# EAGLE design Lightpack5.5 (EAGLE 6.2)
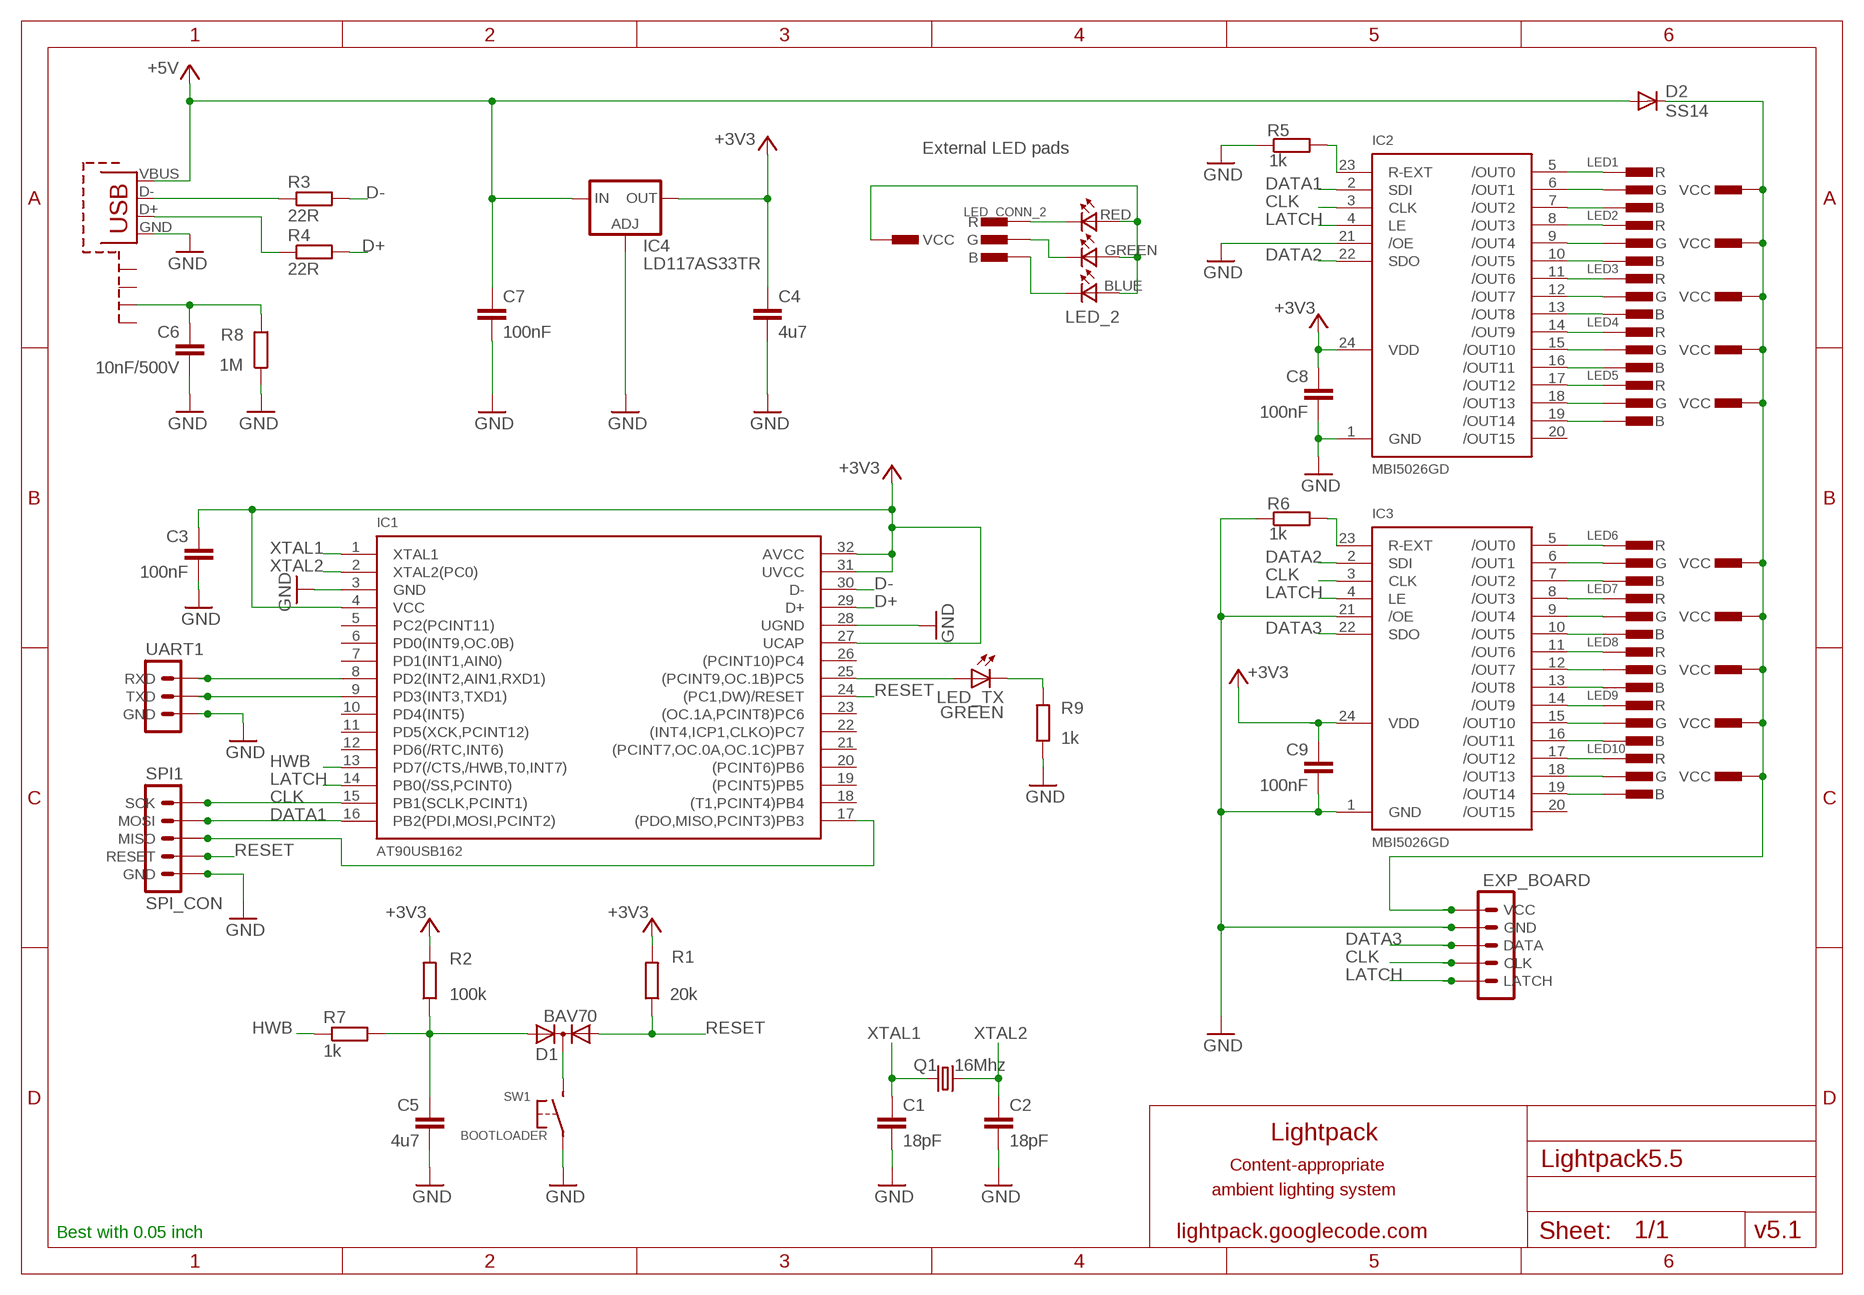
[diagram p0: schematic, sheet 1]

## Parts
C1  18pF  C-EUC1206  [C1206]
C2  18pF  C-EUC1206  [C1206]
C3  100nF  C-EUC1206  [C1206]
C4  4u7  C-EUC1206  [C1206]
C5  4u7  C-EUC1206  [C1206]
C6  10nF/500V  C-EUC1206  [C1206]
C7  100nF  C-EUC1206  [C1206]
C8  100nF  C-EUC1206  [C1206]
C9  100nF  C-EUC1206  [C1206]
D1  BAV70  DIODE-2AC|CASOT23  [SOT23]
D2  SS14  DIODE-SMB  [SMB]
EXP_BOARD  MA05-1  [MA05-1]
IC1  AT90USB162  [TQFP32]
IC2  MBI5026GD  [SOP24-300-1.27]
IC3  MBI5026GD  [SOP24-300-1.27]
IC4  LD117AS33TR  [SOT223]
LED1  CON-RGB-LED  CON-RGB-LED-TH  [CON-RGB-LED-TH]
LED2  CON-RGB-LED  CON-RGB-LED-TH  [CON-RGB-LED-TH]
LED3  CON-RGB-LED  CON-RGB-LED-TH  [CON-RGB-LED-TH]
LED4  CON-RGB-LED  CON-RGB-LED-TH  [CON-RGB-LED-TH]
LED5  CON-RGB-LED  CON-RGB-LED-TH  [CON-RGB-LED-TH]
LED6  CON-RGB-LED  CON-RGB-LED-TH  [CON-RGB-LED-TH]
LED7  CON-RGB-LED  CON-RGB-LED-TH  [CON-RGB-LED-TH]
LED8  CON-RGB-LED  CON-RGB-LED-TH  [CON-RGB-LED-TH]
LED9  CON-RGB-LED  CON-RGB-LED-TH  [CON-RGB-LED-TH]
LED10  CON-RGB-LED  CON-RGB-LED-TH  [CON-RGB-LED-TH]
LED_2  TOPLED-3RF-W2SA50TS  [LP2C63-ST-RGB-SR0]
LED_CONN_2  CON-RGB-LED  CON-RGB-LED-EXT  [CON-RGB-LED-TH-EXT]
LED_TX  GREEN  LEDCHIPLED_0805  [CHIPLED_0805]
Q1  16Mhz  CRYSTALHC49UP  [HC49UP]
R1  20k  R-EU_R1206  [R1206]
R2  100k  R-EU_R1206_2  [R1206]
R3  22R  R-EU_R1206  [R1206]
R4  22R  R-EU_R1206  [R1206]
R5  1k  R-EU_R1206  [R1206]
R6  1k  R-EU_R1206  [R1206]
R7  1k  R-EU_R1206  [R1206]
R8  1M  R-EU_R1206  [R1206]
R9  1k  R-EU_R1206  [R1206]
SPI1  SPI_CON  [NXT_BRD]
SW1  BOOTLOADER  BUTTON  [BUTTON-SMD]
UART1  UART3  [UART3]
X1  USB-MB-S  [USB-MB-S]

## Nets
+3V3 [VCC]: C3.1 C4.1 C8.1 C9.1 IC1.4(VCC) IC1.27(UCAP) IC1.31(UVCC) IC1.32(AVCC) IC2.24(VDD) IC3.24(VDD) IC4.4(OUT) R1.2 R2.1
+5V [VCC]: C7.1 D2.A IC4.3(IN) X1.VBUS
CLK: EXP_BOARD.2(CLK) IC1.15(PB1(SCLK,PCINT1)) IC2.3(CLK) IC3.3(CLK) SPI1.2(SCK)
D+: IC1.29(D+) R4.2
D-: IC1.30(D-) R3.2
DATA1: IC1.16(PB2(PDI,MOSI,PCINT2)) IC2.2(SDI) SPI1.3(MOSI)
DATA2: IC2.22(SDO) IC3.2(SDI)
DATA3: EXP_BOARD.3(DATA) IC3.22(SDO)
GND: C1.2 C2.2 C3.2 C4.2 C5.2 C6.2 C7.2 C8.2 C9.2 EXP_BOARD.4(GND) IC1.3(GND) IC1.28(UGND) IC2.1(GND) IC2.21(/OE) IC3.1(GND) IC3.21(/OE) IC4.1(ADJ) R5.1 R6.1 R8.1 R9.1 SPI1.1-L(GND) SW1.1 UART1.1-L(GND) X1.GND
HWB: IC1.13(PD7(/CTS,/HWB,T0,INT7)) R7.1
LATCH: EXP_BOARD.1(LATCH) IC1.14(PB0(/SS,PCINT0)) IC2.4(LE) IC3.4(LE)
N$1: IC2.23(R-EXT) R5.2
N$2: IC3.8(/OUT3) LED7.3.R(R)
N$3: IC1.17((PDO,MISO,PCINT3)PB3) SPI1.4(MISO)
N$4: IC1.8(PD2(INT2,AIN1,RXD1)) UART1.2(RXD)
N$5: IC2.5(/OUT0) LED1.3.R(R)
N$6: IC2.6(/OUT1) LED1.2.G(G)
N$7: IC2.7(/OUT2) LED1.1.B(B)
N$8: IC1.25((PCINT9,OC.1B)PC5) LED_TX.A
N$9: IC2.8(/OUT3) LED2.3.R(R)
N$10: IC2.9(/OUT4) LED2.2.G(G)
N$11: IC2.10(/OUT5) LED2.1.B(B)
N$12: IC2.11(/OUT6) LED3.3.R(R)
N$13: IC2.12(/OUT7) LED3.2.G(G)
N$14: IC2.13(/OUT8) LED3.1.B(B)
N$15: IC2.14(/OUT9) LED4.3.R(R)
N$16: IC1.9(PD3(INT3,TXD1)) UART1.3-R(TXD)
N$18: IC3.5(/OUT0) LED6.3.R(R)
N$19: IC3.6(/OUT1) LED6.2.G(G)
N$20: IC3.7(/OUT2) LED6.1.B(B)
N$21: IC3.9(/OUT4) LED7.2.G(G)
N$22: IC3.10(/OUT5) LED7.1.B(B)
N$23: IC3.11(/OUT6) LED8.3.R(R)
N$24: IC3.12(/OUT7) LED8.2.G(G)
N$25: IC3.14(/OUT9) LED9.3.R(R)
N$26: IC3.13(/OUT8) LED8.1.B(B)
N$27: IC3.15(/OUT10) LED9.2.G(G)
N$28: IC3.16(/OUT11) LED9.1.B(B)
N$29: IC2.15(/OUT10) LED4.2.G(G)
N$30: IC2.16(/OUT11) LED4.1.B(B)
N$31: IC3.23(R-EXT) R6.2
N$32: R3.1 X1.D-
N$33: R4.1 X1.D+
N$37: LED_TX.C R9.2
N$38: IC2.17(/OUT12) LED5.3.R(R)
N$39: IC2.18(/OUT13) LED5.2.G(G)
N$40: IC2.19(/OUT14) LED5.1.B(B)
N$41: IC3.17(/OUT12) LED10.3.R(R)
N$42: IC3.18(/OUT13) LED10.2.G(G)
N$43: IC3.19(/OUT14) LED10.1.B(B)
N$44: C6.1 R8.2 X1.SHIELD3
N$45: D1.3(C) SW1.2
N$47: C5.1 D1.2(A2) R2.2 R7.2
N$50: LED_2.CRED LED_CONN_2.3.R(R)
N$51: LED_2.CGREEN LED_CONN_2.2.G(G)
N$52: LED_2.CBLUE LED_CONN_2.1.B(B)
N$54: LED_2.BLUE LED_2.GREEN LED_2.RED LED_CONN_2.4.VCC(VCC)
N$57 [VCC]: D2.C EXP_BOARD.5(VCC) LED1.4.VCC(VCC) LED2.4.VCC(VCC) LED3.4.VCC(VCC) LED4.4.VCC(VCC) LED5.4.VCC(VCC) LED6.4.VCC(VCC) LED7.4.VCC(VCC) LED8.4.VCC(VCC) LED9.4.VCC(VCC) LED10.4.VCC(VCC)
RESET: D1.1(A1) IC1.24((PC1,DW)/RESET) R1.1 SPI1.5-R(RESET)
XTAL1: C1.1 IC1.1(XTAL1) Q1.1
XTAL2: C2.1 IC1.2(XTAL2(PC0)) Q1.2
Unconnected: IC1.5(PC2(PCINT11)) IC1.6(PD0(INT9,OC.0B)) IC1.7(PD1(INT1,AIN0)) IC1.10(PD4(INT5)) IC1.11(PD5(XCK,PCINT12)) IC1.12(PD6(/RTC,INT6)) IC1.18((T1,PCINT4)PB4) IC1.19((PCINT5)PB5) IC1.20((PCINT6)PB6) IC1.21((PCINT7,OC.0A,OC.1C)PB7) IC1.22((INT4,ICP1,CLKO)PC7) IC1.23((OC.1A,PCINT8)PC6) IC1.26((PCINT10)PC4) IC2.20(/OUT15) IC3.20(/OUT15) X1.SHIELD1 X1.SHIELD2 X1.SHIELD4

## Notes on the sheet
- External LED pads
- Lightpack
- Content-appropriate
- ambient lighting system
- Best with 0.05 inch | lightpack.googlecode.com | v5.1

## Library data of the parts
C1-C9 = rcl:C-EU: CAPACITOR, European symbol
D1 = diode:DIODE-2AC|CA: Dual DIODE Anode-Cathode|Cathode-Anode
D2 = diode:DIODE-: DIODE
EXP_BOARD = brd-conn:MA05-1: PIN HEADER
IC1 = AT90USB:AT90USB162: AT90USB162 Author: brunql.github.com
IC2 IC3 = MBI5026:MBI5026: MBI5026 Author: brunql.github.com
IC4 = v-reg:LD117A?*: Low drop fixed and adjustable positive voltage regulators 1 A Source: http://www.st.com/stonline/products/literature/ds/7194/ld1117axx.pdf
LED1-LED10 LED_CONN_2 = led-rgb:CON-RGB-LED
LED_2 = led-rgb:TOPLED-3: OSRAM Edited: brunql Removed center pad in pcb - Hyper Multi TOPLED® (RGB) LB E673, LV E673, LT E673 - Power TOPLED® Enhanced optical Power LED (HOP2000) LS E67B, LA E67B, LO E67B, LY E67B - Hyper Multi TOPLED® Enhanced optical Power LED (HOP2000 / ATON®) LATB T66B - Hyper Multi TOPLED® Hyper-Bright LED LATB T686 Source: http://www.osram.convergy.de/
LED_TX = led:LED: LED OSRAM: - CHIPLED LG R971, LG N971, LY N971, LG Q971, LY Q971, LO R971, LY R971 LH N974, LH R974 LS Q976, LO Q976, LY Q976 LO Q996 - Hyper CHIPLED LW Q18S LB Q993, LB Q99A, LB R99A - SideLED LS A670, LO A670, LY A670, LG A670, LP A670 LB A673, LV A673, LT A673, LW A673 LH A674 LY A675 LS A676, LA A676, LO A676, LY A676, LW A676 LS A679, LY A679, LG A679 - Hyper Micro SIDELED® LS Y876, LA Y876, LO Y876, LY Y876 LT Y87S - SmartLED LW L88C, LW L88S LB L89C, LB L89S, LG L890 LS L89K, LO L89K, LY L89K LS L896, LA L896, LO L896, LY L896 - TOPLED LS T670, LO T670, LY T670, LG T670, LP T670 LSG T670, LSP T670, LSY T670, LOP T670, LYG T670 LG T671, LOG T671, LSG T671 LB T673, LV T673, LT T673, LW T673 LH T674 LS T676, LA T676, LO T676, LY T676, LB T676, LH T676, LSB T676, LW T676 LB T67C, LV T67C, LT T67C, LS T67K, LO T67K, LY T67K, LW E67C LS E67B, LA E67B, LO E67B, LY E67B, LB E67C, LV E67C, LT E67C LW T67C LS T679, LY T679, LG T679 LS T770, LO T770, LY T770, LG T770, LP T770 LB T773, LV T773, LT T773, LW T773 LH T774 LS E675, LA E675, LY E675, LS T675 LS T776, LA T776, LO T776, LY T776, LB T776 LHGB T686 LT T68C, LB T68C - Hyper Mini TOPLED® LB M676 - Mini TOPLED Santana® LG M470 LS M47K, LO M47K, LY M47K Source: http://www.osram.convergy.de LUXEON: - LUMILED® LXK2-PW12-R00, LXK2-PW12-S00, LXK2-PW14-U00, LXK2-PW14-V00 LXK2-PM12-R00, LXK2-PM12-S00, LXK2-PM14-U00 LXK2-PE12-Q00, LXK2-PE12-R00, LXK2-PE12-S00, LXK2-PE14-T00, LXK2-PE14-U00 LXK2-PB12-K00, LXK2-PB12-L00, LXK2-PB12-M00, LXK2-PB14-N00, LXK2-PB14-P00, LXK2-PB14-Q00 LXK2-PR12-L00, LXK2-PR12-M00, LXK2-PR14-Q00, LXK2-PR14-R00 LXK2-PD12-Q00, LXK2-PD12-R00, LXK2-PD12-S00 LXK2-PH12-R00, LXK2-PH12-S00 LXK2-PL12-P00, LXK2-PL12-Q00, LXK2-PL12-R00 Source: www.luxeon.com KINGBRIGHT: KA-3528ASYC Source: www.kingbright.com
Q1 = crystal:CRYSTAL: CRYSTAL
R1 R2 R5 R6 = br-zero-res:R-EU_: RESISTOR, European symbol
R3 R4 R7-R9 = rcl:R-EU_: RESISTOR, European symbol
SPI1 = brd-conn:SPI_CON
SW1 = button-smd:BUTTON: Button SMD
UART1 = brd-conn:UART3: PIN HEADER
X1 = USB_miniB:USB: USB Connector miniUSB type B

## Net classes
1 VCC: width 0.6 mm, clearance 0.6 mm

## Board
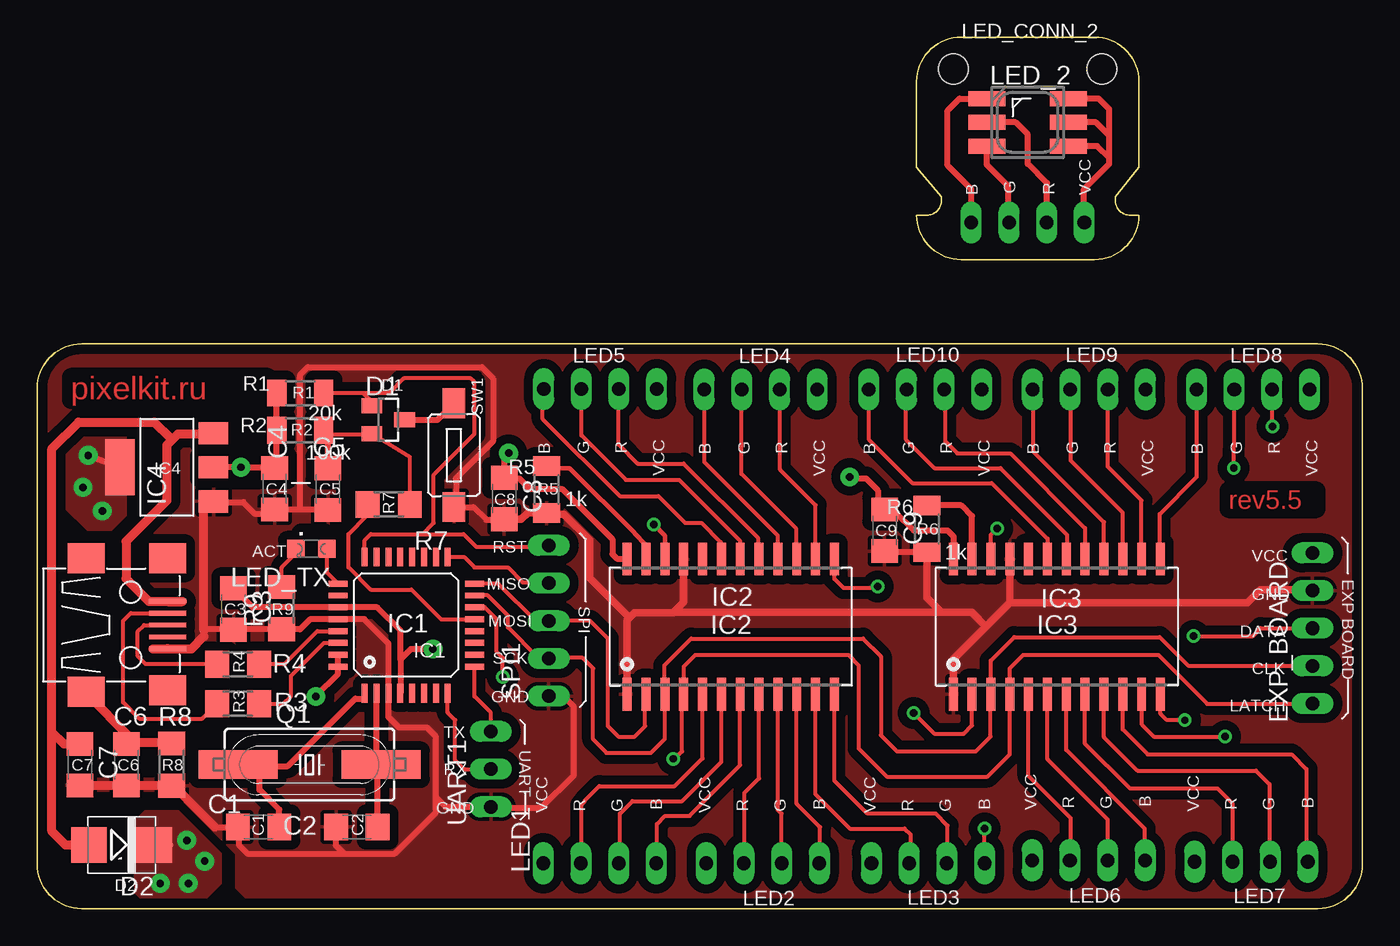
[diagram p1: board, top side]
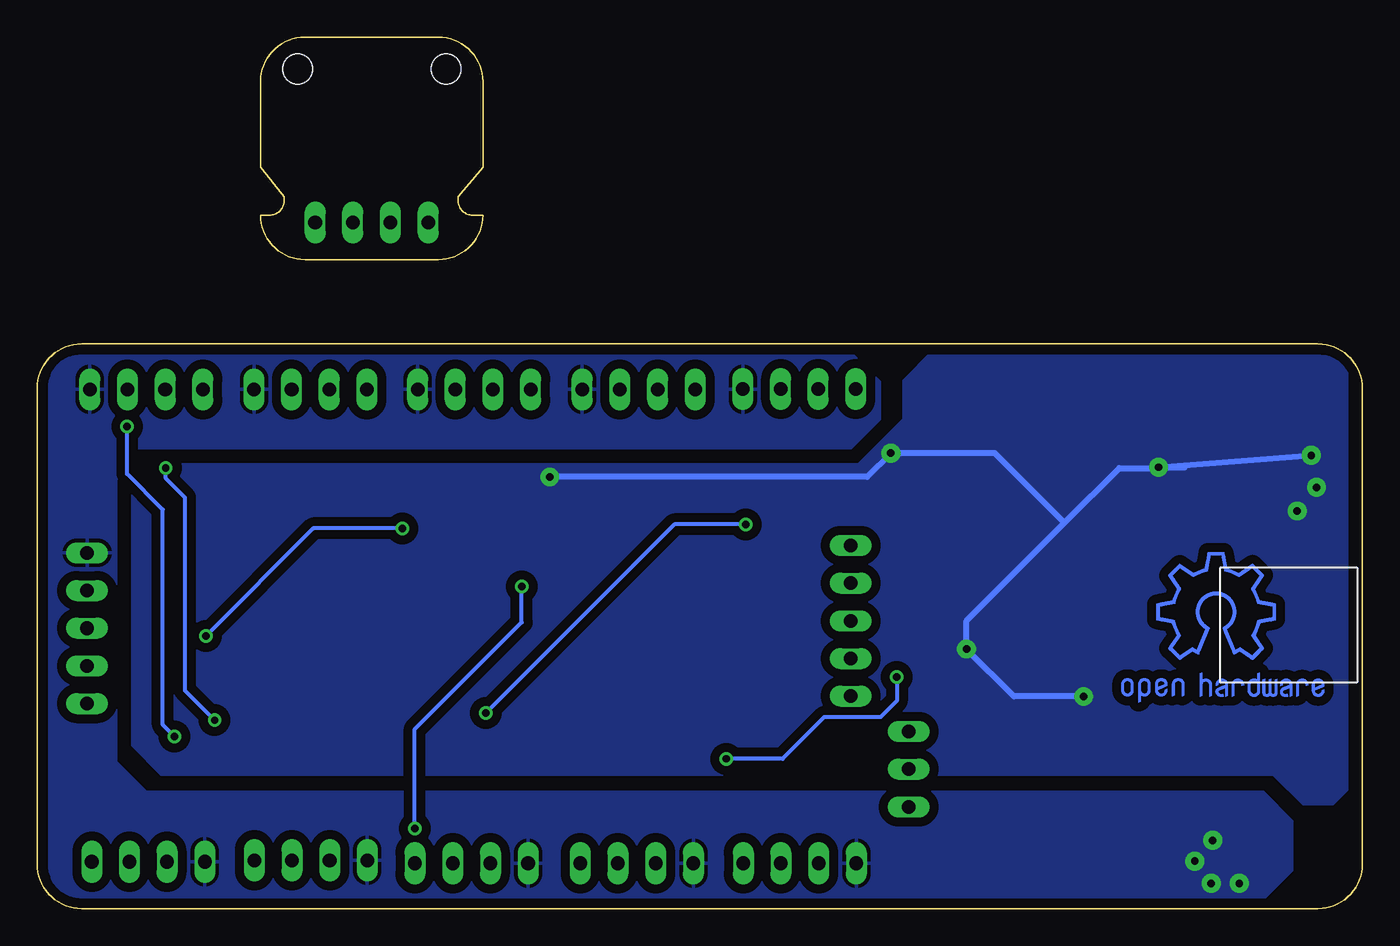
[diagram p2: board, bottom side, seen from below]

Size 89.38 x 58.75 mm. Coordinates in mm from the lower left corner, seen from the top.
Outline: 0,3 arc90 3,0 86.38,0 arc90 89.38,3 89.38,35.06 arc90 86.38,38.06 3,38.06 arc90 0,35.06 0,3
Outline: 59.31,46.75 arc90 62.31,43.75 71.31,43.75 arc90 74.31,46.75 73.7,46.75 arc-90 72.7,47.75 72.7,48 74.31,49.98 74.31,55.75 arc90 71.31,58.75 62.31,58.75 arc90 59.31,55.75 59.31,49.98 61,48 61,47.75 arc-90 60,46.75 59.31,46.75
Copper layers (1*16): Top 0.035mm / dielectric 1.5mm / Bottom 0.035mm
Design rules: minimum track width 10mil, minimum drill 24mil, track to track 8mil, track to pad 8mil, pad to pad 8mil, via to via 8mil, smd to smd 8mil, copper to edge 25mil, drill to drill 8mil, minimum pad ring 10mil, minimum via ring 8mil, stop-mask expansion 4mil, vias tented up to drill 0mil, thermal gap 10mil
Holes 2 mm at 61.8,56.6 71.8,56.6
tRestrict: 37 lines
bRestrict: 1 lines

### Footprints (pad centres in the part's own frame; a part is rotated, then mirrored left to right if it is on the bottom)
C1206 = smd 1.6 x 1.8: 1 -1.4,0; 2 1.4,0
SOT23 = smd 1 x 1.4: 1 -0.95,-1.1; 2 0.95,-1.1; 3 0,1.1
SMB = smd 2.4 x 2.4: A 2.2,0; C -2.2,0
MA05-1 = drill 0.914 long: 1 -5.08,0; 2 -2.54,0; 3 0,0; 4 2.54,0; 5 5.08,0
TQFP32 = smd 1.27 x 0.4: 1 -4.61,2.82; 2 -4.61,2.02; 3 -4.61,1.22; 4 -4.61,0.42; 5 -4.61,-0.38; 6 -4.61,-1.18; 7 -4.61,-1.98; 8 -4.61,-2.78; 17 4.59,-2.78; 18 4.59,-1.98; 19 4.59,-1.18; 20 4.59,-0.38; 21 4.59,0.42; 22 4.59,1.22; 23 4.59,2.02; 24 4.59,2.82 | smd 0.4 x 1.27: 9 -2.81,-4.58; 10 -2.01,-4.58; 11 -1.21,-4.58; 12 -0.41,-4.58; 13 0.39,-4.58; 14 1.19,-4.58; 15 1.99,-4.58; 16 2.79,-4.58; 25 2.79,4.62; 26 1.99,4.62; 27 1.19,4.62; 28 0.39,4.62; 29 -0.41,4.62; 30 -1.21,4.62; 31 -2.01,4.62; 32 -2.81,4.62
SOP24-300-1.27 = smd 0.6 x 2.2: 1 -6.85,-4.635; 2 -5.58,-4.635; 3 -4.31,-4.635; 4 -3.04,-4.635; 5 -1.77,-4.635; 6 -0.5,-4.635; 7 0.77,-4.635; 8 2.04,-4.635; 9 3.31,-4.635; 10 4.58,-4.635; 11 5.85,-4.635; 12 7.12,-4.635; 13 7.12,4.47; 14 5.85,4.47; 15 4.58,4.47; 16 3.31,4.47; 17 2.04,4.47; 18 0.77,4.47; 19 -0.5,4.47; 20 -1.77,4.47; 21 -3.04,4.47; 22 -4.31,4.47; 23 -5.58,4.47; 24 -6.85,4.47
SOT223 = smd 1.5 x 2: 1 -2.3,-3.15; 2 0,-3.15; 3 2.3,-3.15 | smd 3.8 x 2: 4 0,3.15
CON-RGB-LED-TH = drill 0.914 long: 1.B 0,-3.81; 2.G 0,-1.27; 3.R 0,1.27; 4.VCC 0,3.81
LP2C63-ST-RGB-SR0 = smd 2.5 x 1: BLUE 2.75,1.6; CBLUE -2.75,1.6; CGREEN -2.75,-1.6; CRED -2.75,0; GREEN 2.75,-1.6; RED 2.75,0
CON-RGB-LED-TH-EXT = drill 0.914 long: 1.B 0,-3.81; 2.G 0,-1.27; 3.R 0,1.27; 4.VCC 0,3.81
CHIPLED_0805 = smd 1.2 x 1.2: A 0,-1.05; C 0,1.05
HC49UP = smd 5.334 x 1.93: 1 -4.826,0; 2 4.826,0
R1206 = smd 1.3 x 1.803: 1 -1.581,0; 2 1.581,0
R1206' = smd 1.6 x 1.803: 1 -1.422,0; 2 1.422,0
NXT_BRD = drill 0.914 long: 1-L -5.08,0; 2 -2.54,0; 3 0,0; 4 2.54,0; 5-R 5.08,0
BUTTON-SMD = smd 2 x 1.5: 1 -3.5,0; 2 3.5,0
UART3 = drill 0.914 long: 1-L -2.54,0; 2 0,0; 3-R 2.54,0
USB-MB-S = smd 2.5 x 0.32: D+ 2.5,0; D- 2.5,0.8; GND 2.5,-1.6; ID 2.5,-0.8; VBUS 2.5,1.6 | smd 2.5 x 2: SHIELD1 2.5,4.5; SHIELD2 -3,4.5; SHIELD3 -3,-4.5; SHIELD4 2.5,-4.4

### Placement (x,y rotation side)
C1  14.94,5.5 180 top
C2  21.56,5.5 180 top
C3  13.25,20.2 270 top
C4  16.02,28.3 270 top
C5  19.61,28.28 270 top
C6  6.04,9.7 270 top
C7  2.9,9.7 270 top
C8  31.5,27.65 270 top
C9  57.15,25.5 270 top
D1  23.68,32.95 270 top
D2  5.7,4.3 180 top
EXP_BOARD  86,18.9 90 top
IC1  24.91,19.12 90 top
IC2  46.65,19.09 0 top
IC3  68.63,19.09 0 top
IC4  8.75,29.75 90 top
LED1  37.95,3.06 90 top
LED2  48.94,3.06 90 top
LED3  60.08,3.06 90 top
LED4  48.8,35 270 top
LED5  37.97,35.02 270 top
LED6  70.92,3.26 90 top
LED7  81.88,3.16 90 top
LED8  82,35 270 top
LED9  70.94,35 270 top
LED10  59.9,35 270 top
LED_2  66.8,53 0 top
LED_CONN_2  66.81,46.25 270 top
LED_TX  18.5,24.25 90 top
Q1  18.38,9.71 0 top
R1  17.75,34.75 180 top
R2  17.75,32.25 0 top
R3  22R  [R1206']  13.56,13.81 0 top
R4  22R  [R1206']  13.56,16.47 0 top
R5  34.35,28.25 90 top
R6  60.01,25.6 90 top
R7  1k  [R1206']  23.71,27.25 0 top
R8  1M  [R1206']  9.07,9.7 90 top
R9  1k  [R1206']  16.5,20.25 90 top
SPI1  34.5,19.4 90 top
SW1  28.11,30.56 90 top
UART1  30.6,9.4 90 top
X1  6.3,19.12 0 top

### Tracks (layer width: path | path; a pad name or v marks a point on that pad's centre or on a via)
+3V3  (via drill 0.5 pad 1.27)
  Top 0.305: 56.7,26.95 C9.1 56.95,26.7 57.9,26.7 | 61.8,23.58 IC3.24 | 39.8,23.8 IC2.24 39.75,23.6 | C8.1 31.55,29 32.5,29
  Top 0.406: IC1.31 IC1.32 20.3,15.8 v18.8,14.3 | v3.45,30.55 IC4.4 | 12.29,29.7 12.25,29.75 v13.75,29.75 15.98,29.75 C4.1 16.17,29.85 R2.1 R1.2 16.25,34.83 | IC2.24 39.8,23.2 | C9.1 56.85,26.9 | 31.5,29 C8.1 31.5,30.4 v31.8,30.7 | 54.8,29 55.9,29 56.7,28.2 56.7,26.95 | 57.9,26.7 59.1,25.5 61.4,25.5 61.8,25.1 61.8,23.58 | IC1.4 24.5,16.8 | 24.5,16.8 24.5,18.75 22.94,20.31 IC1.27 14.54,20.31 C3.1 | v26.7,17.5 25.2,17.5 24.5,16.8 | 32.5,29 33.2,28.3 35.4,28.3 38.8,24.9 38.8,23.9 39.1,23.6 39.75,23.6 | 54.8,29 54.75,29 | v54.8,29.1 54.8,29
  Bottom 0.406: v13.75,29.75 v3.45,30.55 | v13.75,29.75 12,29.75 | v54.8,29.1 33.4,29.1 v31.8,30.7 | v31.8,30.7 31.7,30.6 | v13.75,29.75 13.7,29.7 | 20.1,26 26.7,19.4 v26.7,17.5 23.5,14.3 v18.8,14.3 | 20.1,26 16.4,29.7 13.8,29.7 v13.75,29.75 | v31.8,30.7 24.8,30.7 20.1,26
  other vias: 3.1,28.4 4.4,26.8
  pour Bottom (isolate 0.61): 3,7 4,7 6,9 81,9 83,11 83,28 81,30 34,30 31,33 31,35.6 29,37.6 1,37.6 1,8 2,7
  pour Top (no thermals): 6,32 3.3,32 1.9,30.6 1.9,27 3.4,25.5 5,25.5 6,26.5
+5V
  Top 0.406: 11.85,32 IC4.3 | 9,31.7 9,31.5
  Top 0.61: 11.85,32 9.5,32 9,31.5 8.75,31.25 8.75,27.5 6,24.75 6,22.25 7.53,20.72 X1.VBUS | 9,31.7 7.9,32.8 2.8,32.8 1,31 1,11.9 | C7.1 1.8,11.1 1,11.9 | 1,11.9 1,5.2 1.9,4.3 D2.A | X1.VBUS 9.78,20.72 9.8,20.7 8.82,20.7 X1.VBUS
CLK
  Top 0.254: IC1.15 30.39,21.11 31.75,19.75 31.75,18.95 33.8,16.9 34.46,16.9 SPI1.2 34.54,16.9 36.8,16.9 37.5,16.2 37.5,11.4 38.4,10.5 41.4,10.5 42.34,11.44 IC2.3 42.3,14.49 42.3,16.4 44.1,18.2 55.7,18.2 56.9,17 56.9,11.7 58,10.6 63.3,10.6 64.3,11.6 64.3,14.43 IC3.3 64.32,16.72 65.9,18.3 75.7,18.3 77.62,16.38 85.98,16.38
  Top 0.305: 85.98,16.38 EXP_BOARD.2
D+
  Top 0.254: IC1.29 18.89,18.71 18.89,18.7 16.7,16.5 15.02,16.5
  Top 0.305: R4.2 15.02,16.5
  Top 0.406: 14.92,15.94 14.92,15.93 R4.2
D-
  Top 0.254: IC1.30 19.34,17.91 17.12,15.69 17.12,14.32 16.6,13.8 R3.2
  Top 0.305: R3.2 14.99,14.2
DATA1
  Top 0.254: 41,13.69 41,12.3 40.3,11.6 39.2,11.6 38.5,12.3 38.5,18.2 37.3,19.4 SPI1.3 34.4,19.3 33.7,19.3 31.09,21.91 IC1.16
  Top 0.406: 41,13.69 IC2.2
DATA2  (via drill 0.5)
  Top 0.254: IC3.2 63.05,12.35 62.5,11.8 60.5,11.8 v59.1,13.2
  Top 0.305: IC2.22 42.35,22.87 42.35,25.15 v41.6,25.9
  Bottom 0.254: v41.6,25.9 46.4,25.9 v59.1,13.2
DATA3  (via drill 0.5)
  Top 0.254: IC3.22 64.32,25.2 v64.75,25.62 | v78,18.38 81.97,18.38 82.5,18.9 EXP_BOARD.3
  Bottom 0.254: v64.75,25.62 70.75,25.62 v78,18.38
GND
  Top 0.305: 39.8,19.77 39.8,19.44 | 42.88,19.94 42.91,19.97 | R6.1 60,24.01
  Top 0.406: 17.75,26.91 C4.2 15.75,26.63 14.67,26.63 13.9,27.4 11.95,27.4 IC4.1 11.25,26.8 | 17.75,26.91 19.59,26.91 C5.2 | 17.75,26.91 17.75,36 18.25,36.5 30,36.5 30.75,35.75 30.75,31.5 28.25,29 28.25,27.21 SW1.1 29.43,27.07 30.3,26.2 31.45,26.2 C8.2 | 13.22,18.83 R9.1 17.73,18.83 18.4,19.5 IC1.28 22.05,19.51 23.7,17.87 IC1.3 23.7,12.9 24.4,12.2 26.3,12.2 26.9,11.6 26.9,7.5 | R6.1 57.83,24.02 C9.2 | 11.25,18.35 11.25,18.75 11.33,18.83 13.22,18.83 | SPI1.1-L 34.52,14.3 35.5,14.3 36.2,13.6 36.2,9 34,6.8 30.66,6.8 UART1.1-L 27.54,6.86 26.9,7.5 | 13.22,18.83 C3.2 | 20.7,3.7 14.2,3.7 13.6,4.3 13.6,5.43 C1.2 12,5.5 | 20.7,3.7 24.1,3.7 26.9,6.5 26.9,7.5 | C2.2 20.16,4.24 20.7,3.7 | 9.05,8.3 R8.1 9.22,8.28
  Top 0.5: IC2.1 39.8,19.44 40.3,19.94 42.88,19.94 | IC2.21 43.6,20.67 42.91,19.97 61,19.97 | 39.8,19.77 37.25,22.31 37.25,24.85 35.5,26.6 34.43,26.6 R5.1 | IC3.1 61.78,16.8 63.99,19.01 | 65.59,20.61 IC3.21 | 63.99,19.01 65.59,20.61 | 61,19.97 63.03,19.97 63.99,19.01 | R6.1 60.01,20.96 61,19.97 | 65.59,20.61 81.61,20.61 82.5,21.5 85.94,21.5 EXP_BOARD.4 | R5.1 34.23,27 | C8.2 32.65,26.25 33.1,26.7 34.33,26.7 R5.1
  Top 0.61: 11.25,18.75 11.25,26.8 | C7.2 C6.2 9.05,8.3 | 9.22,8.28 12,5.5 | 11.25,18.35 10.4,17.5 8.79,17.5 | 8.79,17.5 7.8,17.5 | 8.79,17.5 X1.GND
  pour Top (isolate 0.61): 0.5,37.6 0.5,0.7 0.4,0.6 4.3,0.6 5.3,1.6 5.3,6 6.6,7.3 9.8,7.3 13.4,3.7 13.4,1.4 14.4,0.4 89.1,0.4 89.1,37.7 0.6,37.7
HWB
  Top 0.254: IC1.13 27.25,19.5 25.25,21.5 22.5,21.5 21,23 21,25.25 22.29,26.54
  Top 0.406: IC1.13 | 22.29,26.54 R7.1
LATCH  (via drill 0.5)
  Top 0.254: 43.62,15.12 43.62,16.32 44.4,17.1 54.7,17.1 55.4,16.4 55.4,10.8 57.3,8.9 64.1,8.9 65.6,10.4 IC3.4 65.59,16.19 66.5,17.1 75.6,17.1 78.9,13.8 85.98,13.8 | 30.19,20.31 31,19.5 31,17.3 31.4,16.9 v31.4,15.6 | 43.5,13.65 43.5,10.6 43,10.1
  Top 0.305: IC2.4 43.6,15.11 43.62,15.12 | 85.98,13.8 EXP_BOARD.1 | 30.19,20.31 IC1.14 | v42.9,10.1 43,10.1
  Top 0.406: 43.5,13.65 IC2.4
  Bottom 0.254: v31.4,15.6 31.4,14 32.5,12.9 36.3,12.9 39.1,10.1 v42.9,10.1
N$1
  Top 0.305: IC2.23 41.06,24.51 40.27,25.3 40.27,25.33 35.9,29.7 34.49,29.7 R5.2
N$2
  Top 0.254: IC3.8 70.67,11.13 73.7,8.1 79.6,8.1 80.6,7.1 LED7.3.R
  Top 0.305: LED7.3.R
N$3
  Top 0.254: IC1.17 28.79,23.71 29.5,23 31.75,23 32.75,22 34.44,22
  Top 0.305: IC1.17 27.7,24.01
  Top 0.406: 34.44,22 SPI1.4
N$4
  Top 0.254: IC1.8 27.7,13.21 28.2,12.7 28.2,10 28.8,9.4 UART1.2
N$5
  Top 0.254: IC2.5 44.88,10.12 43,8.25 37.9,8.25 36.95,7.3 36.95,7.25 36.7,7 36.7,3.08
  Top 0.305: LED1.3.R 36.7,3.08
N$6
  Top 0.254: IC2.6 46.15,9.89 43.5,7.25 40.15,7.25 39.3,6.4 39.3,3.14
  Top 0.305: LED1.2.G 39.3,3.14
N$7
  Top 0.254: IC2.7 47.41,9.66 44,6.25 42.35,6.25 41.8,5.7 41.8,3.1
  Top 0.305: LED1.1.B 41.8,3.1
N$8
  Top 0.254: LED_TX.A 19.55,22.65 IC1.25
N$9
  Top 0.254: IC2.8 48.69,8.79 47.7,7.8 47.7,3.09
  Top 0.305: LED2.3.R 47.7,3.09
N$10
  Top 0.254: IC2.9 49.95,6.64 50.2,6.4 LED2.2.G
  Top 0.305: LED2.2.G
N$11
  Top 0.254: IC2.10 51.23,7.07 52.8,5.5 52.8,3.11
  Top 0.305: LED2.1.B 52.8,3.11
N$12
  Top 0.254: IC2.11 52.49,7.71 54.8,5.4 58.5,5.4 58.9,5 58.9,3.15
  Top 0.305: 58.9,3.15 LED3.3.R
N$13
  Top 0.254: IC2.12 53.77,8.63 56,6.4 60.6,6.4 61.4,5.6 61.4,3.11
  Top 0.305: LED3.2.G 61.4,3.11
N$14  (via drill 0.5)
  Top 0.254: IC2.13 53.77,22.23 54.4,21.6 56.6,21.6 | LED3.1.B 63.89,5.38 v63.9,5.4
  Top 0.305: v56.7,21.7 56.6,21.6
  Bottom 0.254: v56.7,21.7 56.7,19.3 63.9,12.1 v63.9,5.4
N$15
  Top 0.254: IC2.14 52.49,27.2 50.1,29.6 50.1,34.97
  Top 0.305: 50.1,34.97 LED4.3.R
N$16
  Top 0.254: 30.64,11.9 UART1.3-R 30.6,13.2 29.5,14.3 IC1.9
N$18
  Top 0.254: IC3.5 66.86,8.94 69.7,6.1 69.7,3.31
  Top 0.305: LED6.3.R 69.7,3.31
N$19
  Top 0.254: IC3.6 68.13,10.07 72.2,6 72.2,3.27
  Top 0.305: LED6.2.G 72.2,3.27
N$20
  Top 0.254: IC3.7 69.4,10.7 74.7,5.4 74.7,3.28
  Top 0.305: 74.8,3.33 LED6.1.B 74.7,3.28
N$21
  Top 0.254: IC3.9 71.94,11.56 74.2,9.3 82.2,9.3 83.1,8.4 83.1,3.21
  Top 0.305: 83.1,3.21 LED7.2.G
N$22
  Top 0.254: IC3.10 73.21,12.09 74.9,10.4 84.6,10.4 85.6,9.4 85.6,3.25
  Top 0.305: 85.6,3.25 LED7.1.B
N$23  (via drill 0.5)
  Top 0.254: 74.5,13.73 74.5,12.4 75.3,11.6 v80.1,11.6 | v83.3,32.5 83.3,34.97
  Top 0.305: 74.5,13.73 IC3.11 | 83.3,34.97 LED8.3.R
  Bottom 0.254: v83.3,32.5 83.3,29.3 80.9,26.9 80.9,12.4 v80.1,11.6
N$24  (via drill 0.5)
  Top 0.254: IC3.12 75.75,13.15 76.2,12.7 v77.4,12.7 | LED8.2.G 80.73,32.44 v80.7,29.7
  Top 0.305: LED8.2.G 80.7,34.96
  Bottom 0.254: v80.7,29.7 80.7,29 79.4,27.7 79.4,14.7 v77.4,12.7
N$25
  Top 0.254: IC3.14 74.48,27.52 72.2,29.8 72.2,34.99
  Top 0.305: 72.2,34.99 LED9.3.R
N$26
  Top 0.254: LED8.1.B 78.2,29.1 75.7,26.6 75.7,23.61 IC3.13
  Top 0.305: LED8.1.B
N$27
  Top 0.254: IC3.15 73.21,26.69 69.7,30.2 69.7,34.97
  Top 0.305: 69.7,34.97 LED9.2.G
N$28
  Top 0.254: 71.95,22.87 71.95,26.05 67.2,30.8 67.2,34.93
  Top 0.305: 71.95,22.87 IC3.16 | 67.2,34.93 LED9.1.B
N$29
  Top 0.254: 47.5,34.97 47.5,29.3 51.2,25.6 51.2,23.58
  Top 0.305: 47.5,34.97 LED4.2.G | IC2.15 51.2,23.58
N$30
  Top 0.254: IC2.16 49.95,25.14 45,30.1 LED4.1.B
N$31
  Top 0.406: R6.2 62.32,27.18 63.05,26.45 IC3.23
N$32
  Top 0.254: X1.D- 6.32,19.92 5.8,19.4 5.8,13.9 6.9,12.8 11.13,12.8 R3.1
N$33
  Top 0.254: X1.D+ 7.22,19.12 6.8,18.7 6.8,17 7.3,16.5 12.11,16.5
  Top 0.305: 12.11,15.9 R4.1 12.11,16.5
  Top 0.406: 11.68,15.88 12.12,15.88 R4.1
N$37
  Top 0.254: 17.45,23.95 16.5,23 R9.2
  Top 0.406: 17.45,23.95 LED_TX.C
N$38
  Top 0.254: 48.6,24.55 48.6,25 43.6,30 40.5,30 39.2,31.3 39.2,34.98
  Top 0.305: 48.62,22.92 IC2.17 48.65,22.89 48.65,24.5 48.6,24.55 | 39.2,34.98 LED5.3.R
N$39
  Top 0.254: 47.4,24.21 47.4,24.8 43.3,28.9 39.7,28.9 36.7,31.9 LED5.2.G
  Top 0.305: IC2.18 47.38,22.9 47.38,24.19 47.4,24.21
N$40
  Top 0.254: 46.1,24.25 46.1,24.7 44.8,26 43.7,26 41.9,27.8 39.3,27.8 34.1,33 34.1,34.96
  Top 0.305: IC2.19 46.12,22.88 | IC2.19 46.05,22.95 | IC2.19 46.15,22.86 46.15,24.2 46.1,24.25 | 34.1,34.96 LED5.1.B
N$41
  Top 0.254: IC3.17 70.67,25.64 65.62,30.69 62.06,30.69 61.25,31.5 61.25,34.85
  Top 0.305: 61.25,34.85 LED10.3.R
N$42
  Top 0.254: 69.45,22.91 69.45,25.2 64.96,29.69 60.51,29.69 58.6,31.6 58.6,34.97
  Top 0.305: 69.45,22.91 IC3.18 | 58.6,34.97 LED10.2.G
N$43
  Top 0.254: IC3.19 68.13,24.93 64.38,28.69 59.01,28.69 56.1,31.6 56.1,34.99
  Top 0.305: 56.1,34.99 LED10.1.B
N$44
  Top 0.406: X1.SHIELD3 3.5,14.82 3.5,14.3 | 6.1,11.7 6.1,11.16 C6.1 6.24,10.77 6.24,11.16 6.2,11.2 | 9,11.2 R8.2
  Top 0.61: 3.5,14.3 6.1,11.7 | 6.2,11.2 9,11.2
N$45
  Top 0.406: D1.3 27,32.95 SW1.2
N$47
  Top 0.254: R7.2 25.14,30.45 D1.2 | 19.61,31.97 22.54,31.97
  Top 0.406: C5.1 19.61,31.97 R2.2 | 22.54,31.97 D1.2
N$50
  Top 0.406: LED_2.CRED 66,53 66.8,52.2 66.8,50.2 68.1,48.9 68.1,46.27 LED_CONN_2.3.R
N$51
  Top 0.406: LED_2.CGREEN 64.05,50.15 65.5,48.7 65.5,46.29 LED_CONN_2.2.G
N$52
  Top 0.406: 63.1,46.35 LED_CONN_2.1.B 63,48.5 61.4,50.1 61.4,53.8 62.2,54.6 LED_2.CBLUE
N$54
  Top 0.406: LED_2.BLUE 71.6,54.6 72.3,53.9 72.3,52.1 | 72.3,50.6 72.3,50.2 70.6,48.5 70.6,46.27 LED_CONN_2.4.VCC | 72.3,50.6 72.3,52.1 | LED_2.RED 71.4,53 72.3,52.1 | LED_2.GREEN 71.5,51.4 72.3,50.6
N$57  (via drill 0.5 pad 1.27)
  Top 0.406: D2.C 9,4.3
  other vias: 8.3,1.7 10.2,1.7 11.3,3.2 10.1,4.6
  pour Bottom: 6.7,0.6 4.7,2.6 4.7,5.9 6.7,7.9 82,7.9 84,9.9 84,28.9 82.4,30.7 82.1,31 34.5,31 32.5,33 32.5,35.5 34.5,37.5 88.7,37.5 88.7,0.6
  pour Top (no thermals): 6.7,5.4 6.7,6 7.3,6.6 9.5,6.6 12.4,3.7 12.4,1.7 11.1,0.4 7.3,0.4 6.6,1.1 6.6,5.3
RESET
  Top 0.254: IC1.24 22.09,24.84 22.5,25.25 26,25.25 | 22,34.75 23.73,34.75 24.73,35.75 29.25,35.75 29.5,35.5 29.5,32 26.75,29.25 26.75,26 26,25.25 | 22,34.75 R1.1 | 22,34.75 22.58,34.17 | 26,25.25 28.75,25.25 29.6,24.4 34.42,24.4
  Top 0.406: 22.58,34.17 D1.1 | 34.42,24.4 SPI1.5-R
XTAL1
  Top 0.305: 22.09,14.16 IC1.1 | 15,9.6 13.66,9.6 Q1.1
  Top 0.406: 22.09,14.16 21.46,14.16 16.9,9.6 15,9.6 15,8 16.34,6.66 C1.1
XTAL2
  Top 0.305: 22.89,10.01 Q1.2 22.96,9.47
  Top 0.406: 22.89,10.01 IC1.2 | C2.1 22.96,9.47
(copper drawn outside any net)
  shapes: Bottom area x6913

### Text on the board
Top: pixelkit.ru | rev5.5
tPlace: D1 | R1 | R2 | IC4 | C4 | C5 | R5 | R7 | C8 | C9 | R6 | ACT | RST | VCC | MISO | EXP BOARD | GND | C3 | R9 | SPI | IC1 | MOSI | IC2 | IC3 | DATA | R4 | SCK | CLK | GND | R3 | LATCH | TX | UART | C7 | C6 | R8 | RX | GND | C1 | C2 | D2
tTest: C:/Users/Panda/Desktop/Untitled-1.bmp | C:/Users/Panda/Desktop/Untitled-1.bmp | C:/Users/Panda/Desktop/Untitled-1.bmp